# EAGLE schematic dhunter_bike (EAGLE 6.4)
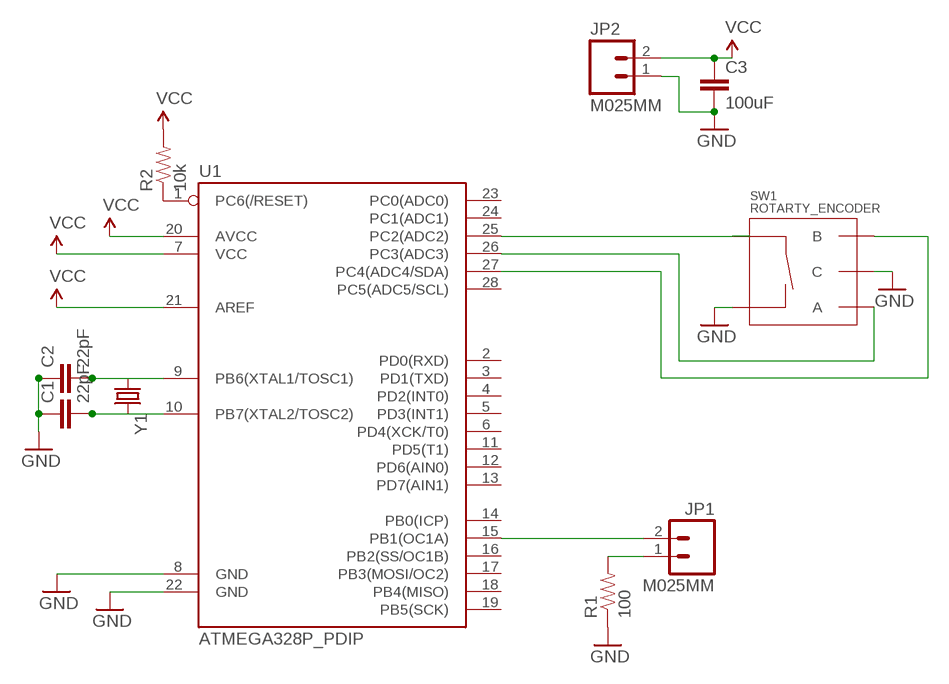
[diagram p0: schematic, sheet 1]

## Parts
C1  22pF  CAPEZ  [CAP-PTH-SMALLEZ]
C2  22pF  CAPEZ  [CAP-PTH-SMALLEZ]
C3  100uF  CAPEZ  [CAP-PTH-SMALLEZ]
JP1  M025MM  [SCREWTERMINAL-5MM-2]
JP2  M025MM  [SCREWTERMINAL-5MM-2]
R1  100  RESISTOREZ  [AXIAL-0.3EZ]
R2  10k  RESISTOREZ  [AXIAL-0.3EZ]
SW1  ROTARTY_ENCODER  [ROTARY_ENC_PLAIN]
U1  ATMEGA328P_PDIP  [DIL28-3]
Y1  CRYSTALHC49US  [HC49US]

## Nets
GND: C1.1 C2.1 C3.2 JP2.1 R1.P$1 SW1.C SW1.SW- U1.8(GND) U1.22(GND)
N$2: SW1.SW+ U1.25(PC2(ADC2))
N$5: C1.2 U1.10(PB7(XTAL2/TOSC2)) Y1.2
N$6: C2.2 U1.9(PB6(XTAL1/TOSC1)) Y1.1
N$7: JP1.2 U1.15(PB1(OC1A))
N$8: JP1.1 R1.P$2
N$9: R2.P$1 U1.1(PC6(/RESET))
ROTA: SW1.A U1.26(PC3(ADC3))
ROTB: SW1.B U1.27(PC4(ADC4/SDA))
VCC: C3.1 JP2.2 R2.P$2 U1.7(VCC) U1.20(AVCC) U1.21(AREF)
Unconnected: U1.2(PD0(RXD)) U1.3(PD1(TXD)) U1.4(PD2(INT0)) U1.5(PD3(INT1)) U1.6(PD4(XCK/T0)) U1.11(PD5(T1)) U1.12(PD6(AIN0)) U1.13(PD7(AIN1)) U1.14(PB0(ICP)) U1.16(PB2(SS/OC1B)) U1.17(PB3(MOSI/OC2)) U1.18(PB4(MISO)) U1.19(PB5(SCK)) U1.23(PC0(ADC0)) U1.24(PC1(ADC1)) U1.28(PC5(ADC5/SCL))

## Library data of the parts
C1-C3 = SparkFun-Capacitors:CAP: Capacitor Standard 0603 ceramic capacitor, and 0.1" leaded capacitor.
JP1 JP2 = SparkFun-Connectors:M02: Standard 2-pin 0.1" header. Use with - straight break away headers ( PRT-00116) - right angle break away headers (PRT-00553) - swiss pins (PRT-00743) - machine pins (PRT-00117) - female headers (PRT-00115) Molex polarized connector foot print use with: PRT-08233 with associated crimp pins and housings. 2.54_SCREWTERM for use with PRT-10571. 3.5mm Screw Terminal footprints for PRT-08084 5mm Screw Terminal footprints for use with PRT-08433
R1 R2 = SparkFun-Passives:RESISTOR: Resistor Basic schematic elements and footprints for 0603, 1206, and PTH resistors.
SW1 = SparkFun-Electromechanical:ROTARTY_ENCODER: Simple no LED rotary encoder Example: COM-09117
U1 = SparkFun-DigitalIC:ATMEGA328P_PDIP: uC used in the Arduino 32kb flash, 1k EEPROM, 2k SRAM This is the through-hole version of this chip.
Y1 = SparkFun-FreqCtrl:CRYSTAL: Various standard crystals. Proven footprints. Spark Fun Electronics SKU : COM-00534